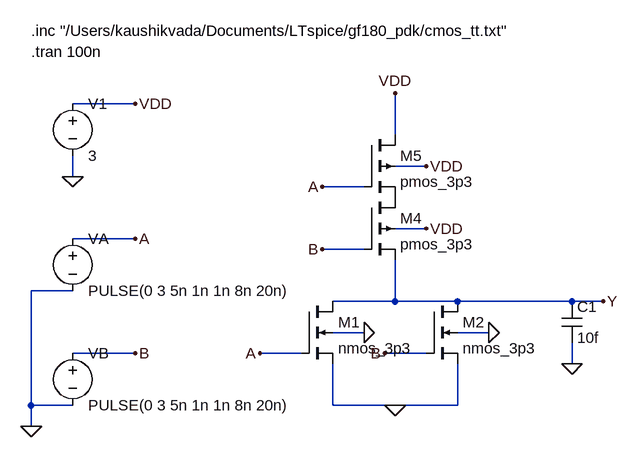
[diagram p0: schematic Q2_3.asc]
Q2_3.asc, the LTspice schematic file:
Version 4
SHEET 1 1200 700
WIRE 128 80 224 80
WIRE 128 160 128 192
WIRE 128 288 224 288
WIRE 64 368 128 368
WIRE 128 464 224 464
WIRE 64 544 128 544
WIRE 64 368 64 576
WIRE 624 64 624 128
WIRE 624 320 624 384
WIRE 528 384 944 384
WIRE 528 480 528 544
WIRE 720 480 720 544
WIRE 528 544 720 544
WIRE 896 448 896 480
WIRE 512 208 576 208
WIRE 512 304 576 304
WIRE 416 464 480 464
WIRE 608 464 672 464
WIRE 624 176 672 176
WIRE 624 272 672 272
WIRE 528 432 576 432
WIRE 720 432 768 432
FLAG 224 80 VDD
FLAG 128 192 0
FLAG 224 288 A
FLAG 224 464 B
FLAG 64 576 0
FLAG 624 64 VDD
FLAG 944 384 Y
FLAG 624 544 0
FLAG 896 480 0
FLAG 512 208 A
FLAG 512 304 B
FLAG 416 464 A
FLAG 608 464 B
FLAG 672 176 VDD
FLAG 672 272 VDD
FLAG 576 432 0
FLAG 768 432 0
SYMBOL voltage 128 64 R0
SYMATTR InstName V1
SYMATTR Value 3
SYMBOL voltage 128 272 R0
SYMATTR InstName VA
SYMATTR Value PULSE(0 3 5n 1n 1n 8n 20n)
SYMBOL voltage 128 448 R0
SYMATTR InstName VB
SYMATTR Value PULSE(0 3 5n 1n 1n 8n 20n)
SYMBOL pmos4 576 128 R0
SYMATTR InstName M5
SYMATTR Value pmos_3p3
SYMATTR SpiceLine W=8u L=1u
SYMBOL pmos4 576 224 R0
SYMATTR InstName M4
SYMATTR Value pmos_3p3
SYMATTR SpiceLine W=8u L=1u
SYMBOL nmos4 480 384 R0
SYMATTR InstName M1
SYMATTR Value nmos_3p3
SYMATTR SpiceLine W=2u L=1u
SYMBOL nmos4 672 384 R0
SYMATTR InstName M2
SYMATTR Value nmos_3p3
SYMATTR SpiceLine W=2u L=1u
SYMBOL cap 880 384 R0
SYMATTR InstName C1
SYMATTR Value 10f
TEXT 64 -32 Left 2 !.inc "/Users/kaushikvada/Documents/LTspice/gf180_pdk/cmos_tt.txt"
TEXT 64 0 Left 2 !.tran 100n

The netlist it stands for:
* Q2_3.asc
V1 VDD 0 3
VA A 0 PULSE(0 3 5n 1n 1n 8n 20n)
VB B 0 PULSE(0 3 5n 1n 1n 8n 20n)
M5 VDD A P001 VDD pmos_3p3 W=8u L=1u
M4 P001 B Y VDD pmos_3p3 W=8u L=1u
M1 Y A 0 0 nmos_3p3 W=2u L=1u
M2 Y B 0 0 nmos_3p3 W=2u L=1u
C1 Y 0 10f
.model NMOS NMOS
.model PMOS PMOS
.lib standard.mos
.inc "/Users/kaushikvada/Documents/LTspice/gf180_pdk/cmos_tt.txt"
.tran 100n
.backanno
.end